# EAGLE design pxbee-trigger (EAGLE 9.6.2)
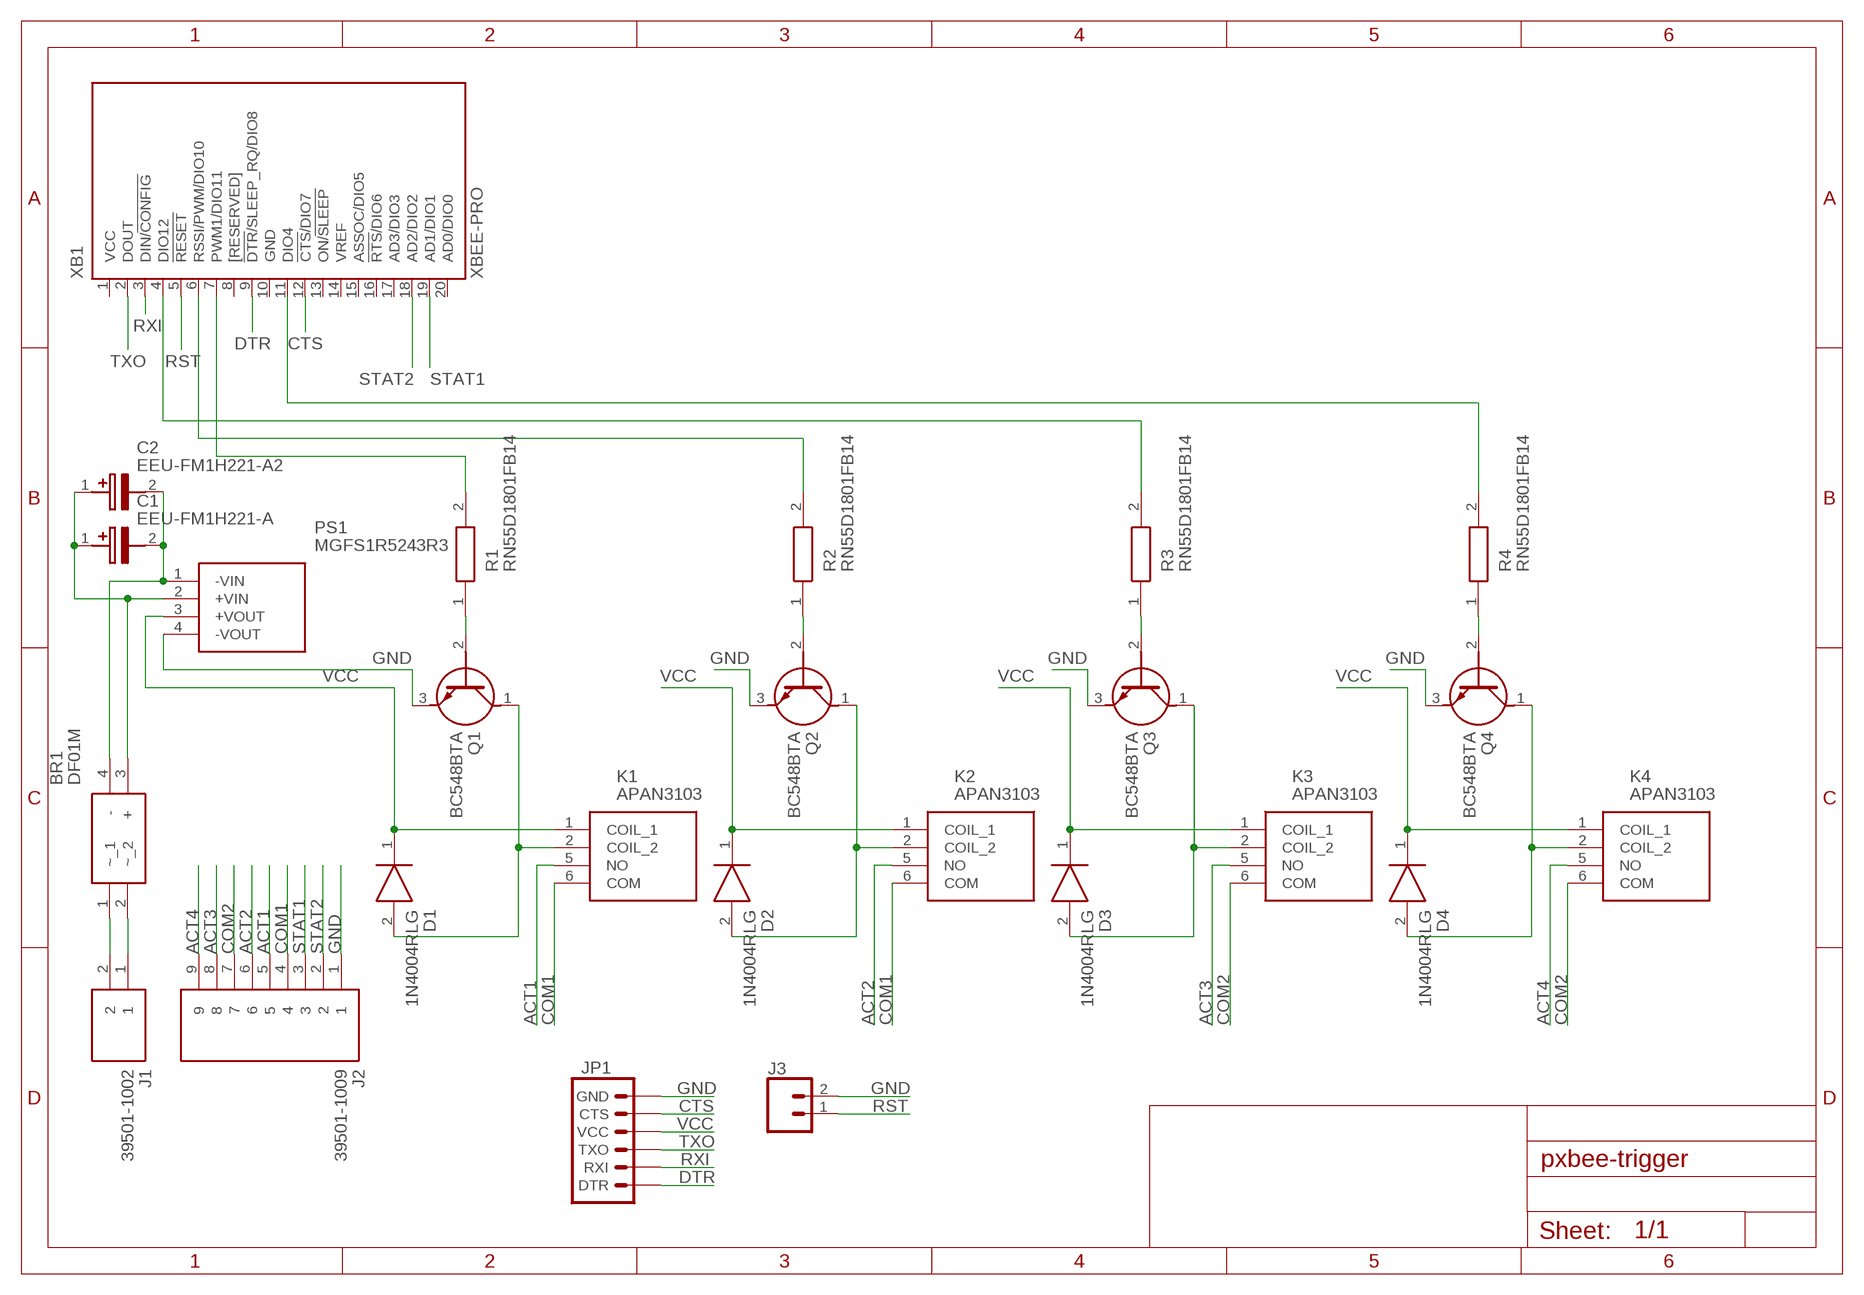
[diagram p0: schematic, sheet 1]

## Parts
BR1  DF01M  [DIP825W114P510L828H330Q4N]
C1  EEU-FM1H221-A  [CAPANGLED]
C2  EEU-FM1H221-A2  [CAPANGLED-B]
D1  1N4004RLG  [DIOAD1405W86L465D235]
D2  1N4004RLG  [DIOAD1405W86L465D235]
D3  1N4004RLG  [DIOAD1405W86L465D235]
D4  1N4004RLG  [DIOAD1405W86L465D235]
J1  39501-1002  [395011002]
J2  39501-1009  [SHDR9W80P0X350_1X9_3290X690X96]
J3  CONN_02  [1X02]
JP1  6_PIN_SERIAL_TARGETSILK  [6_PIN_SERIAL_TARGET_SIDE_W_SILK]
K1  APAN3103  [APAN3103]
K2  APAN3103  [APAN3103]
K3  APAN3103  [APAN3103]
K4  APAN3103  [APAN3103]
PS1  MGFS1R5243R3  [MGFS1R52415]
Q1  BC548BTA  [BC548BTA]
Q2  BC548BTA  [BC548BTA]
Q3  BC548BTA  [BC548BTA]
Q4  BC548BTA  [BC548BTA]
R1  RN55D1801FB14  [RESAD1526W69L610D229]
R2  RN55D1801FB14  [RESAD1526W69L610D229]
R3  RN55D1801FB14  [RESAD1526W69L610D229]
R4  RN55D1801FB14  [RESAD1526W69L610D229]
XB1  XBEE-PRO  [XBEE-PRO]

## Nets
ACT1: J2.5 K1.5(NO)
ACT2: J2.6 K2.5(NO)
ACT3: J2.8 K3.5(NO)
ACT4: J2.9 K4.5(NO)
COM1: J2.4 K1.6(COM) K2.6(COM)
COM2: J2.7 K3.6(COM) K4.6(COM)
CTS: JP1.P$5(CTS) XB1.12(!CTS!/DIO7)
DTR: JP1.P$1(DTR) XB1.9(!DTR!/SLEEP_RQ/DIO8)
GND: J2.1 J3.2 JP1.P$6(GND) PS1.4(-VOUT) Q1.3(E) Q2.3(E) Q3.3(E) Q4.3(E)
N$1: Q1.2(B) R1.1
N$2: Q2.2(B) R2.1
N$3: D1.2(A) K1.2(COIL_2) Q1.1(C)
N$4: D2.2(A) K2.2(COIL_2) Q2.1(C)
N$5: Q3.2(B) R3.1
N$6: D3.2(A) K3.2(COIL_2) Q3.1(C)
N$7: Q4.2(B) R4.1
N$8: BR1.1(~_1) J1.2
N$9: BR1.2(~_2) J1.1
N$12: D4.2(A) K4.2(COIL_2) Q4.1(C)
N$13: R1.2 XB1.7(PWM1/DIO11)
N$14: R2.2 XB1.6(RSSI/PWM/DIO10)
N$15: R3.2 XB1.4(DIO12)
N$16: R4.2 XB1.11(DIO4)
RST: J3.1 XB1.5(!RESET)
RXI: JP1.P$3(RXI) XB1.3(DIN/!CONFIG)
STAT1: J2.3 XB1.19(AD1/DIO1)
STAT2: J2.2 XB1.18(AD2/DIO2)
TXO: JP1.P$2(TXO) XB1.2(DOUT)
VCC: D1.1(K) D2.1(K) D3.1(K) D4.1(K) JP1.P$4(VCC) K1.1(COIL_1) K2.1(COIL_1) K3.1(COIL_1) K4.1(COIL_1) PS1.3(+VOUT)
VIN+: BR1.3(+) C1.1(+) C2.1(+) PS1.2(+VIN)
VIN-: BR1.4(-) C1.2(-) C2.2(-) PS1.1(-VIN)
Unconnected: XB1.8([RESERVED]) XB1.13(ON/!SLEEP) XB1.14(VREF) XB1.15(ASSOC/DIO5) XB1.16(!RTS!/DIO6) XB1.17(AD3/DIO3) XB1.20(AD0/DIO0)

## Power pins joined to a net without a drawn wire
GND: XB1.10(GND)
VCC: XB1.1(VCC)

## Library data of the parts
BR1 = parts:DF01M: ON SEMICONDUCTOR - DF01M - BRIDGE RECTIFIER, 1.5A, 100V, 4-DIP Source: Datasheet <https://componentsearchengine.com/Datasheets/2/DF01M.pdf>; ARROW_PART_NUMBER: DF01M; ARROW_PRICE-STOCK: https://www.arrow.com/en/products/df01m/on-semiconductor; DESCRIPTION: ON SEMICONDUCTOR - DF01M - BRIDGE RECTIFIER, 1.5A, 100V, 4-DIP; HEIGHT: 3.3mm; MANUFACTURER_NAME: ON Semiconductor; MANUFACTURER_PART_NUMBER: DF01M; MOUSER_PART_NUMBER: 512-DF01M; MOUSER_PRICE-STOCK: https://www.mouser.co.uk/ProductDetail/ON-Semiconductor-Fairchild/DF01M?qs=jEaxvrTvpac4Wk7%2Fu%252BjpDQ%3D%3D
C1 C2 = parts:EEU-FM1H221: Panasonic Aluminium Electrolytic Capacitor 220uF 50V dc 10mm Through Hole FM Radial Series +105C Source: Datasheet <https://componentsearchengine.com/Datasheets/2/EEUFM1H221.pdf>
D1-D4 = parts:1N4004RLG: Rectifiers 400V 1A Standard Source: Datasheet <http://www.onsemi.com/pub/Collateral/1N4001-D.PDF>; DESCRIPTION: Rectifiers 400V 1A Standard; HEIGHT: mm; MANUFACTURER_NAME: ON Semiconductor; MANUFACTURER_PART_NUMBER: 1N4004RLG; MOUSER_PART_NUMBER: 863-1N4004RLG; MOUSER_PRICE-STOCK: https://www.mouser.com/Search/Refine.aspx?Keyword=863-1N4004RLG; RS_PART_NUMBER: 1844627P; RS_PRICE-STOCK: http://uk.rs-online.com/web/p/products/1844627P
J1 = parts:39501-1002: Pluggable Terminal Blocks 3.5MM EURO HDR 02P VT CLOSED Source: Datasheet <https://mouser.componentsearchengine.com/Datasheets/2/39501-1002.pdf>; ALLIED_NUMBER: 71469767; ALLIED_PRICE-STOCK: https://www.alliedelec.com/molexincorporated-39501-1002/71469767/; DESCRIPTION: Pluggable Terminal Blocks 3.5MM EURO HDR 02P VT CLOSED; HEIGHT: 9.6mm; MANUFACTURER_NAME: Molex; MANUFACTURER_PART_NUMBER: 39501-1002; MOUSER_PART_NUMBER: 538-39501-1002; MOUSER_PRICE-STOCK: https://www.mouser.com/Search/Refine.aspx?Keyword=538-39501-1002
J2 = parts:39501-1009: Pluggable Terminal Blocks EURO 3.5MM 9 CIRCUIT VERT PCB HEADER Source: Datasheet <https://www.molex.com/pdm_docs/sd/395011009_sd.pdf>; DESCRIPTION: Pluggable Terminal Blocks EURO 3.5MM 9 CIRCUIT VERT PCB HEADER; HEIGHT: 9.6mm; MANUFACTURER_NAME: Molex; MANUFACTURER_PART_NUMBER: 39501-1009; MOUSER_PART_NUMBER: 538-39501-1009; MOUSER_PRICE-STOCK: https://www.mouser.com/Search/Refine.aspx?Keyword=538-39501-1009
J3 = SparkFun-Connectors:CONN_02: Multi connection point. Often used as Generic Header-pin footprint for 0.1 inch spaced/style header connections On any of the 0.1 inch spaced packages, you can populate with these: Break Away Headers - Straight <https://www.sparkfun.com/products/116> (PRT-00116) Break Away Male Headers - Right Angle <https://www.sparkfun.com/products/553> (PRT-00553) Female Headers <https://www.sparkfun.com/products/115> (PRT-00115) Break Away Headers - Machine Pin <https://www.sparkfun.com/products/117> (PRT-00117) Break Away Female Headers - Swiss Machine Pin <https://www.sparkfun.com/products/743> (PRT-00743) For SCREWTERMINALS and SPRING TERMINALS visit here: Screw Terimnals on SparkFun.com <https://www.sparkfun.com/search/results?term=Screw+Terminals> (5mm/3.5mm/2.54mm spacing) This device is also useful as a general connection point to wire up your design to another part of your project. Our various solder wires solder well into these plated through hole pads. Hook-Up Wire - Assortment (Stranded, 22 AWG) <https://www.sparkfun.com/products/11375> (PRT-11375) Hook-Up Wire - Assortment (Solid Core, 22 AWG) <https://www.sparkfun.com/products/11367> (PRT-11367) View the entire wire category on our website here <https://www.sparkfun.com/categories/141> Special notes: Molex polarized connector foot print use with: PRT-08233 with associated crimp pins and housings. 2.54_SCREWTERM for use with PRT-10571. 3.5mm Screw Terminal footprints for PRT-08084 5mm Screw Terminal footprints for use with PRT-08432
JP1 = SparkFun-Connectors:6_PIN_SERIAL_TARGET: 6-pin header connection for use with the "FTDI BASIC" pinout - TARGET SIDE. Also known as "Arduino Serial Program Header". It is used to mate with our FTDI Basic serial programmers using the Arduino IDE. Note, this device has "TARGET" in the name. It is intended to be used on a design that contains a target micro-controller that you wish to program. The "sister" device, named "CABLE" is inteneded to be used on a design that usually lives on the end of your USB cable and prvides the converter chip (FTDI232 or FTDI231x) to commnicate serial RX/TX. You can populate with some of these: Break Away Headers - Straight <https://www.sparkfun.com/products/116> (PRT-00116) For reference (or to suit your programming needs) check out these designs: SparkFun FTDI Basic Breakout - 5V <https://www.sparkfun.com/products/9716> (DEV-09716) SparkFun FTDI Basic Breakout - 3.3V <https://www.sparkfun.com/products/9873> (DEV-09873) SparkFun FTDI SmartBasic <https://www.sparkfun.com/products/12935> (DEV-12935) SparkFun Beefy 3 - FTDI Basic Breakout <https://www.sparkfun.com/products/13746> (DEV-13746)
K1-K4 = parts:APAN3103: General Purpose Relays 3.0volts 1 Form A PLC Relay Source: Datasheet <https://b2b-api.panasonic.eu/file_stream/pids/fileversion/7801>; ALLIED_NUMBER: 70879222; ALLIED_PRICE-STOCK: https://www.alliedelec.com/panasonic-apan3103/70879222/; DESCRIPTION: General Purpose Relays 3.0volts 1 Form A PLC Relay; HEIGHT: 12.5mm; MANUFACTURER_NAME: Panasonic; MANUFACTURER_PART_NUMBER: APAN3103; MOUSER_PART_NUMBER: 769-APAN3103; MOUSER_PRICE-STOCK: https://www.mouser.com/Search/Refine.aspx?Keyword=769-APAN3103
PS1 = parts:MGFS1R5243R3: Cosel MGF 1.32W Isolated DC-DC Converter PCB Mount, Voltage in 9 36 V dc, Voltage out 3.3V dc Source: Datasheet <https://en.cosel.co.jp/tool/tag/pdf/SFE_MGFS.pdf>; DESCRIPTION: Cosel MGF 1.32W Isolated DC-DC Converter PCB Mount, Voltage in 9 36 V dc, Voltage out 3.3V dc; HEIGHT: 12mm; MANUFACTURER_NAME: Cosel; MANUFACTURER_PART_NUMBER: MGFS1R5243R3; MOUSER_PART_NUMBER: 436-MGFS1R5243R3; MOUSER_PRICE-STOCK: https://www.mouser.com/Search/Refine.aspx?Keyword=436-MGFS1R5243R3; RS_PART_NUMBER: 1715286P; RS_PRICE-STOCK: http://uk.rs-online.com/web/p/products/1715286P
Q1-Q4 = parts:BC548BTA: NPN Epitaxial Silicon Transistor, TO-92 Source: Datasheet <https://componentsearchengine.com/Datasheets/2/BC548BTA.pdf>; DESCRIPTION: NPN Epitaxial Silicon Transistor, TO-92; HEIGHT: 5.33mm; MANUFACTURER_NAME: ON Semiconductor; MANUFACTURER_PART_NUMBER: BC548BTA; MOUSER_PART_NUMBER: 512-BC548BTA; MOUSER_PRICE-STOCK: https://www.mouser.com/Search/Refine.aspx?Keyword=512-BC548BTA; RS_PART_NUMBER: 8031093P; RS_PRICE-STOCK: http://uk.rs-online.com/web/p/products/8031093P
R1-R4 = parts:RN55D1801FB14: Metal Film Resistors - Through Hole 1/8watt 1.8Kohms 1% 100ppm Source: Datasheet <https://componentsearchengine.com/Datasheets/1/RN55D1801FB14.pdf>; DESCRIPTION: Metal Film Resistors - Through Hole 1/8watt 1.8Kohms 1% 100ppm; HEIGHT: mm; MANUFACTURER_NAME: Vishay; MANUFACTURER_PART_NUMBER: RN55D1801FB14; MOUSER_PART_NUMBER: 71-RN55D1801FB14; MOUSER_PRICE-STOCK: https://www.mouser.com/Search/Refine.aspx?Keyword=71-RN55D1801FB14
XB1 = xbee:XBEE: XBee (TM) /XBee-PRO(TM) OEM RF Modules Based on the original package by MaxStream, Inc Improvements to the package by Sten Feldman: Connecting all the pins of the PRO variant Silkscreen updates for spacing and pin numbers; MPN: XBP24-AWI-001; OC_FARNELL: 1337916; OC_NEWARK: 42M2667

## Board
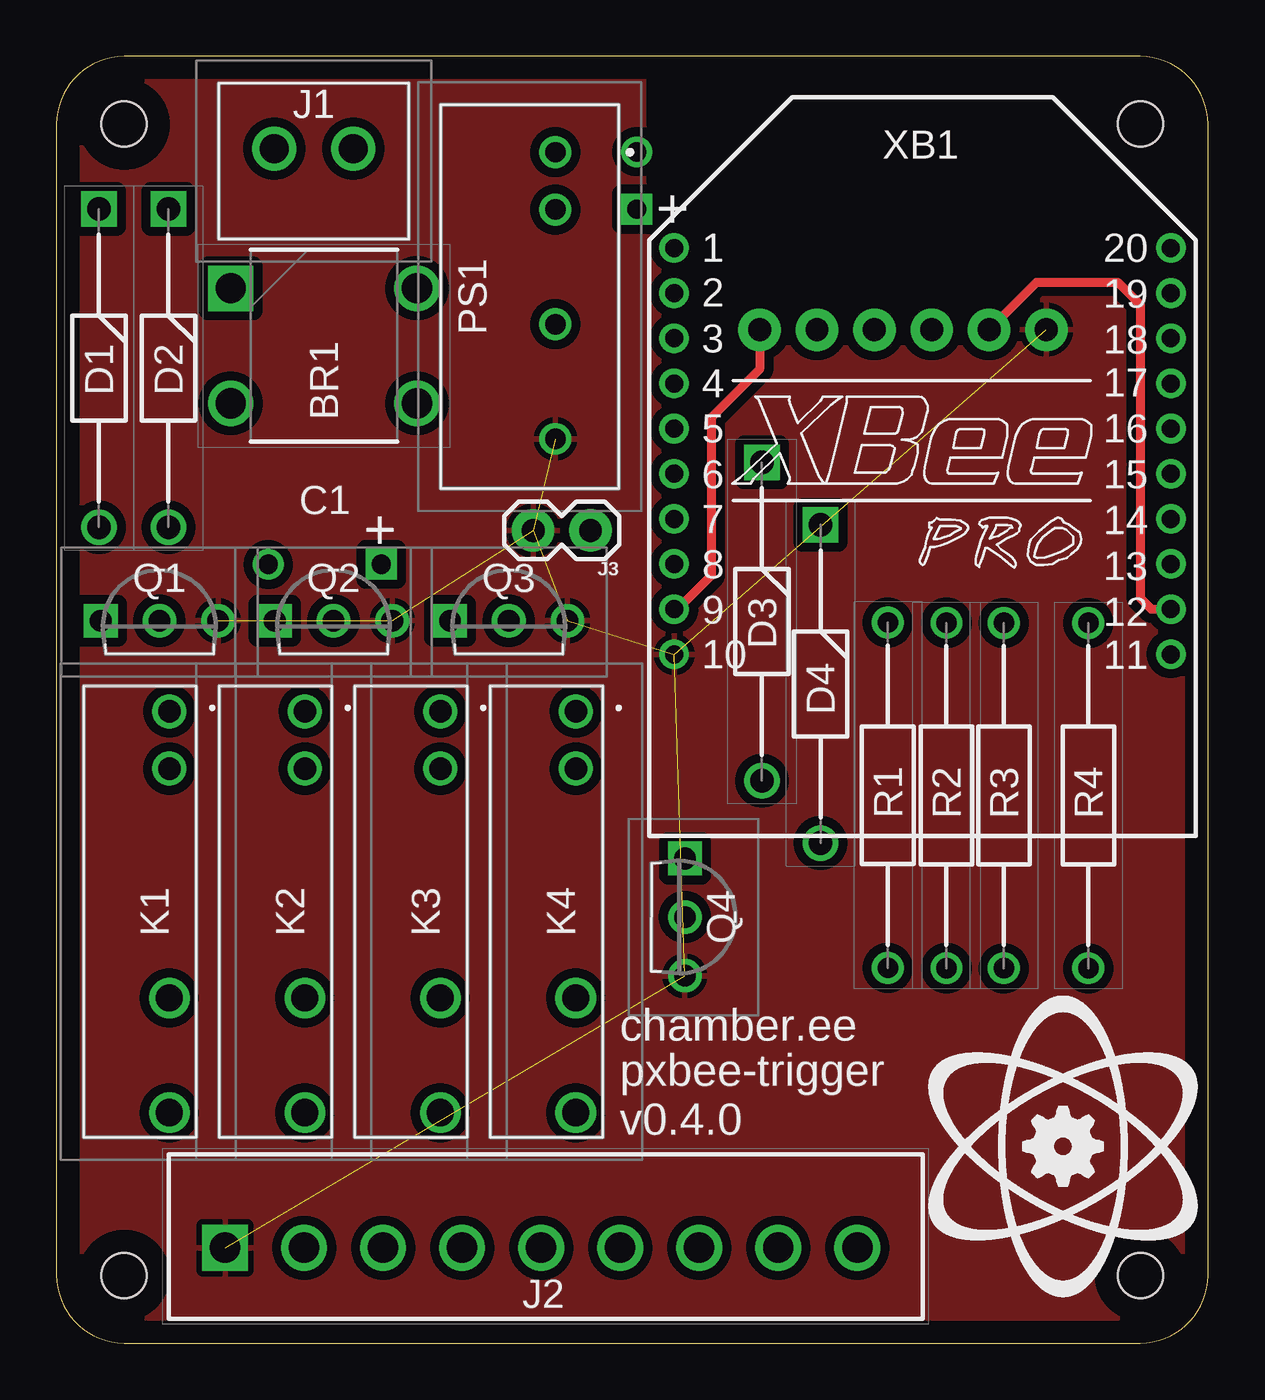
[diagram p1: board, top side]
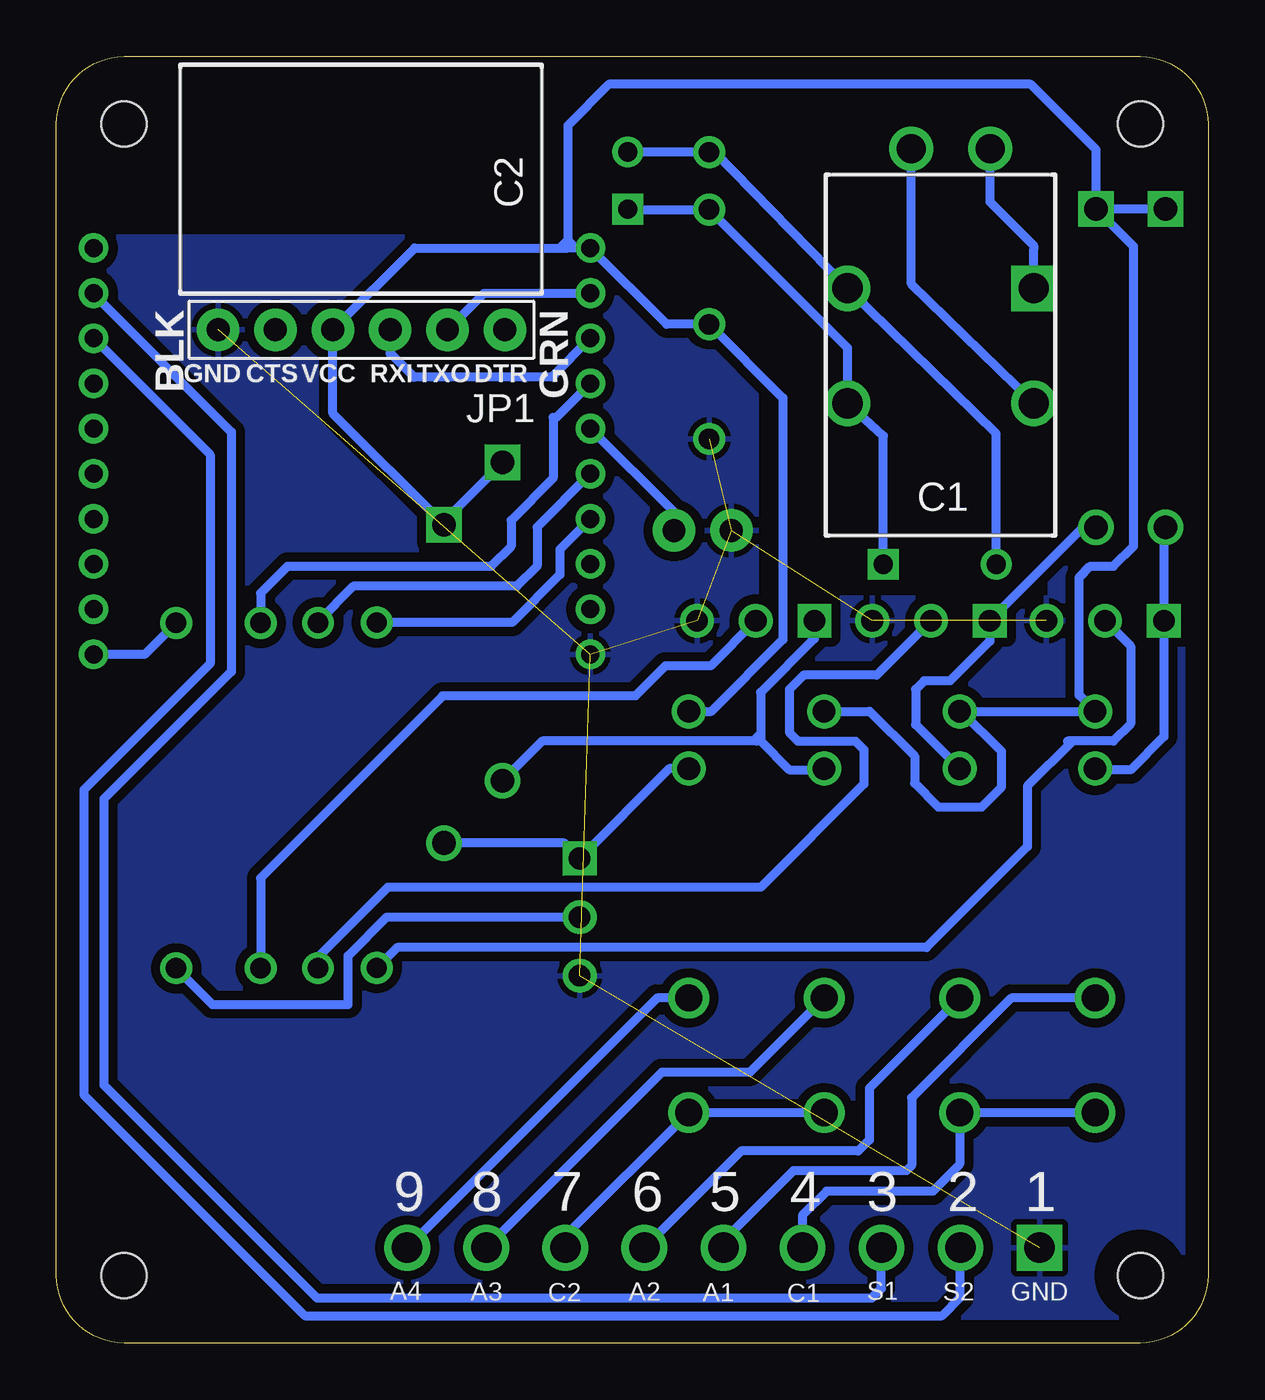
[diagram p2: board, bottom side, seen from below]

Size 51 x 57 mm. Coordinates in mm from the lower left corner, seen from the top.
Outline: 3,0 48,0 arc90 51,3 51,54 arc90 48,57 3,57 arc90 0,54 0,3 arc90 3,0
Copper layers (1*16): Top 0.035mm / dielectric 1.5mm / Bottom 0.035mm
Design rules "default": minimum track width 6mil, minimum drill 0.35mm, track to track 6mil, track to pad 6mil, pad to pad 6mil, via to via 6mil, smd to smd 6mil, copper to edge 40mil, drill to drill 6mil, minimum pad ring 10mil, minimum via ring 8mil, stop-mask expansion 4mil, vias tented up to drill 0mil, thermal gap 10mil
Holes 2 mm at 3,3 48,3 48,54 3,54

### Footprints (pad centres in the part's own frame; a part is rotated, then mirrored left to right if it is on the bottom)
DIP825W114P510L828H330Q4N = drill 1.34 pad 1.74 square: 1 -4.125,2.55 | drill 1.34 pad 1.74: 2 -4.125,-2.55; 3 4.125,-2.55; 4 4.125,2.55
CAPANGLED = drill 0.85 pad 1.275 square: 1 0,0 | drill 0.85 pad 1.275: 2 5,0
CAPANGLED-B = drill 0.85 pad 1.275 square: 1 1.21,0 | drill 0.85 pad 1.275: 2 3.75,0
DIOAD1405W86L465D235 = drill 1.05 pad 1.575 square: 1 0,0 | drill 1.05 pad 1.575: 2 14.1,0
395011002 = drill 1.3 pad 1.95: 1 0,0; 2 3.5,0
SHDR9W80P0X350_1X9_3290X690X96 = drill 1.35 pad 2.025 square: 1 0,0 | drill 1.35 pad 2.025: 2 3.5,0; 3 7,0; 4 10.5,0; 5 14,0; 6 17.5,0; 7 21,0; 8 24.5,0; 9 28,0
1X02 = drill 1.016 pad 1.88: 1 0,0; 2 2.54,0
6_PIN_SERIAL_TARGET_SIDE_W_SILK = drill 1.016 pad 1.88: P$1 -6.35,0; P$2 -3.81,0; P$3 -1.27,0; P$4 1.27,0; P$5 3.81,0; P$6 6.35,0
APAN3103 = drill 1 pad 1.5: 1 0,0; 2 2.54,0 | drill 1.2 pad 1.8: 5 12.7,0; 6 17.78,0
MGFS1R52415 = drill 0.9 pad 1.4: 1 -6.4,1.14; 2 -3.86,1.14; 3 1.22,1.14; 4 6.3,1.14
BC548BTA = drill 0.96 pad 1.493 square: 1 0,0 | drill 0.96 pad 1.493: 2 2.6,0; 3 5.2,0
RESAD1526W69L610D229 = drill 0.9 pad 1.35: 1 0,0; 2 15.3,0
XBEE-PRO = drill 0.8 pad 1.27: 1 -11,8.746; 2 -11,6.746; 3 -11,4.746; 4 -11,2.746; 5 -11,0.746; 6 -11,-1.254; 7 -11,-3.254; 8 -11,-5.254; 9 -11,-7.254; 10 -11,-9.254; 11 11,-9.254; 12 11,-7.254; 13 11,-5.254; 14 11,-3.254; 15 11,-1.254; 16 11,0.746; 17 11,2.746; 18 11,4.746; 19 11,6.746; 20 11,8.746

### Placement (x,y rotation side)
BR1  11.84,44.18 0 top
C1  14.38,34.5 0 bottom
C2  25.7,49.02 90 bottom
D1  1.88,50.24 270 top
D2  4.96,50.24 270 top
D3  31.25,39.01 270 top
D4  33.84,36.25 270 top
J1  13.14,52.91 180 top
J2  7.46,4.22 0 top
J3  23.65,36 180 top
JP1  37.49,44.89 180 bottom
K1  5,27.99 270 top
K2  11,27.99 270 top
K3  17,27.99 270 top
K4  23,27.99 270 top
PS1  20.95,46.36 270 top
Q1  1.96,32 0 top
Q2  9.67,32 0 top
Q3  17.43,32 0 top
Q4  27.83,21.47 270 top
R1  36.82,16.62 90 top
R2  39.41,16.61 90 top
R3  41.96,16.61 90 top
R4  45.7,16.61 90 top
XB1  38.35,39.77 0 top

### Tracks (layer width: path | path; a pad name or v marks a point on that pad's centre or on a via)
ACT1
  Bottom 0.406: K1.5 8.71,15.29 13.13,10.87 13.13,7.87 13.37,7.63 18.36,7.63 21.46,4.54 J2.5
ACT2
  Bottom 0.406: K2.5 15,11.29 15,9 15.49,8.51 20.68,8.51 J2.6
ACT3
  Bottom 0.406: K3.5 20.29,12 24.19,12 J2.8
ACT4
  Bottom 0.406: K4.5 24.4,15.29 J2.9
COM1
  Bottom 0.406: K1.6 K2.6 11,7.92 12.19,6.73 16.89,6.73 17.96,5.66 J2.4
COM2
  Bottom 0.406: K3.6 K4.6 28.46,4.74 J2.7
CTS
  Top 0.406: XB1.12 48.49,32.51 48,33 48,46 47,47 43.41,47 JP1.P$5
DTR
  Top 0.406: JP1.P$1 31.14,43.14 29,41 29,34 27.51,32.51 XB1.9
GND  (8 unrouted)
  pour Bottom (isolate 0.406): 0,0 51,0 51,49 27.16,49 24.16,46 21,46 20,45 20,33 7,33 7,57 0,57
  pour Top (isolate 0.406): 0,0 51,0 51,49 26,49 26,57 0,57
N$1
  Bottom 0.406: Q1.2 3.43,30.87 3.43,27.43 4.19,26.67 6,26.67 | 6,26.67 6.22,26.67 | R1.1 35.92,17.53 12.47,17.53 8,22 8,24.67 6,26.67
N$2
  Bottom 0.406: R2.1 39.41,17.1 36.32,20.19 19.81,20.19 15.24,24.77 15.24,26.29 15.62,26.67 18.16,26.67 18.54,27.05 18.54,28.96 17.91,29.59 14.68,29.59 Q2.2
N$3
  Bottom 0.406: D1.2 1.96,36.06 Q1.1 1.96,26.87 3.43,25.4 4.95,25.4 K1.2
N$4
  Bottom 0.406: K2.2 12.95,27.4 12.95,28.96 12.57,29.34 11.43,29.34 9.67,31.1 Q2.1 5.53,36.14 D2.2
N$5
  Bottom 0.406: R3.1 41.96,20.61 33.89,28.67 25.36,28.67 24.03,30 22.03,30 Q3.2
N$6
  Bottom 0.406: K3.2 17.05,25.4 18.54,25.4 19.81,26.67 | Q3.1 17.43,31.21 19.81,28.83 19.81,27 | 19.81,27 19.81,26.67 | D3.2 29.49,26.67 20,26.67 | 19.81,26.67 20,26.67 | 19.81,27 20,26.81 20,26.67
N$7
  Bottom 0.406: R4.1 44.09,15 38.08,15 38.08,17.16 36.37,18.87 Q4.2
N$8
  Bottom 0.406: BR1.1 7.72,48.48 7.73,48.62 9.65,50.55 9.65,52.9 J1.2
N$9
  Bottom 0.406: BR1.2 13.14,46.92 J1.1
N$12
  Bottom 0.406: D4.2 28.51,22.15 Q4.1 23.86,25.45 K4.2
N$13
  Bottom 0.406: XB1.7 28.7,35.16 28.7,34.04 30.82,31.92 R1.2
N$14
  Bottom 0.406: XB1.6 29.72,36.15 29.72,34.42 30.61,33.53 37.85,33.53 39.41,31.96 R2.2
N$15
  Bottom 0.406: R3.2 41.96,33.23 40.77,34.42 31.73,34.42 30.86,35.29 30.86,36.45 29,38.31 29,41 28.87,41 XB1.4
N$16
  Bottom 0.406: R4.2 47.09,30.51 XB1.11
RST
  Bottom 0.406: J3.1 23.65,36.81 XB1.5
RXI
  Bottom 0.406: JP1.P$3 36.22,43.85 35.19,42.81 | 35.19,42.81 35.16,42.79 | 35.19,42.81 29.05,42.81 XB1.3
STAT1
  Bottom 0.406: XB1.19 49.35,46.47 43.25,40.37 43.25,29.75 48.9,24.11 48.9,11.43 39.47,2 14.89,2 14.46,2.43 J2.3
STAT2
  Bottom 0.406: XB1.18 44.2,39.35 44.2,30.1 49.78,24.51 49.78,11 40,1.22 11.78,1.22 10.96,2.04 J2.2
TXO
  Bottom 0.406: JP1.P$2 32.06,46.51 XB1.2
VCC
  Bottom 0.406: 28.7,48.51 28.36,48.51 | 28,48.51 XB1.1 23.98,45.14 PS1.3 18.83,41.87 18.83,31.16 22,27.99 K4.1 | 28,48.51 28.36,48.51 | D2.1 4.96,52.87 7.86,55.76 26.53,55.76 28.36,53.94 28.36,48.87 | 28.36,48.86 28.36,48.51 | D1.1 D2.1 | D2.1 3.3,48.58 3.3,35.31 4.19,34.42 5.21,34.42 5.71,33.91 5.71,28.7 K1.1 10.92,27.99 | K2.1 10.92,27.99 | K3.1 14.99,27.99 13,26 13,24.81 11.94,23.75 10.03,23.75 9.14,24.64 9.14,26.21 10.92,27.99 | D3.1 33.84,36.42 D4.1 38.76,41.18 JP1.P$4 35.14,48.51 28.7,48.51 | 28.36,48.87 28,48.51 | 28.36,48.87 28.36,48.86 | 28.36,48.86 28.7,48.51
VIN+
  Bottom 0.406: C1.1 14.38,40.18 BR1.3 15.97,44.04 15.97,44.09 PS1.2 25.68,50.22 C2.1
VIN-
  Bottom 0.406: C1.2 9.38,40.28 BR1.4 21.86,52.76 PS1.1 22.11,52.77 C2.2

### Text on the board
tPlace: + | C1 | + | chamber.ee | pxbee-trigger | v0.4.0
bPlace: 1 | 2 | 3 | 4 | 5 | 6 | 7 | 8 | 9 | GND | S2 | S1 | C1 | A1 | A2 | C2 | A3 | A4